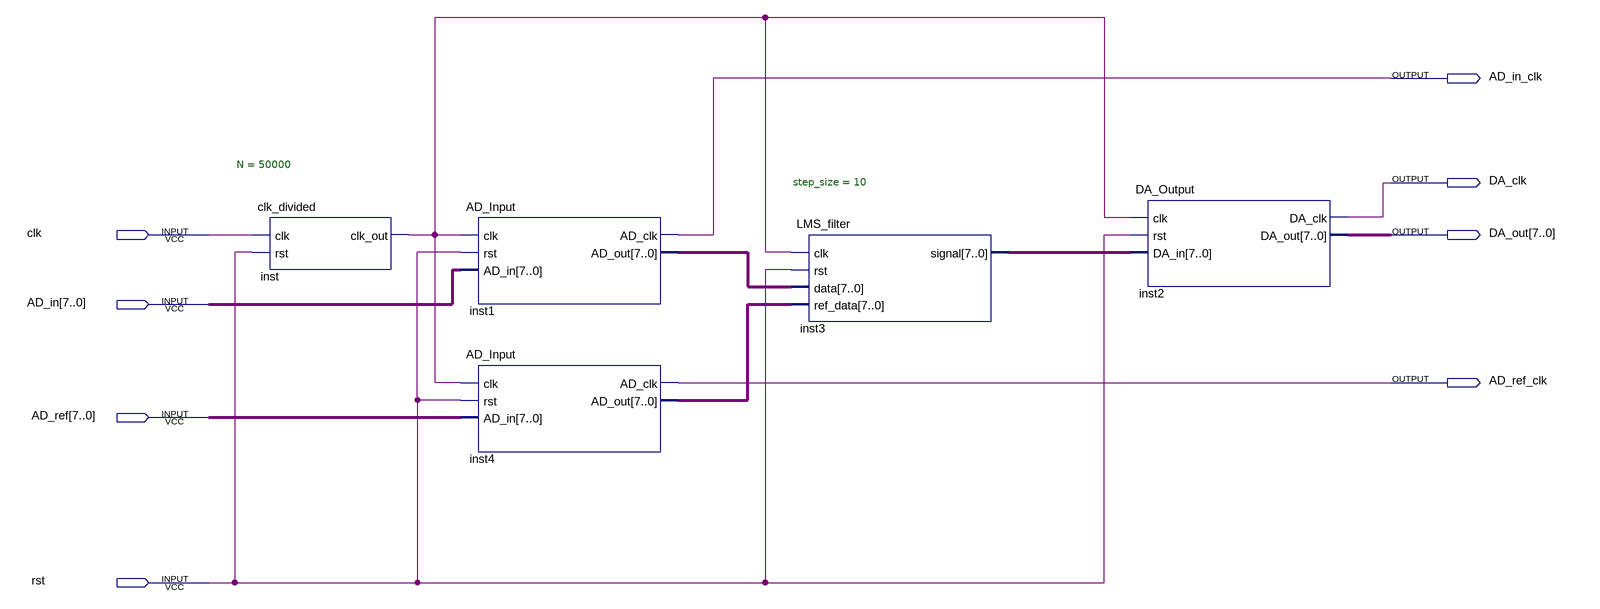
[diagram p0: schematic sheet]
// Quartus schematic ECG.bdf as structural Verilog: 5 symbols, 8 pins
module ECG (
  input  clk,
  input  [7:0] AD_in,
  input  [7:0] AD_ref,
  input  rst,
  output AD_in_clk,
  output DA_clk,
  output [7:0] DA_out,
  output AD_ref_clk
);

  wire inst_clk_out;
  wire [7:0] inst1_ad_out, inst3_signal, inst4_ad_out;

  clk_divided #(.N(50000)) inst (.clk(clk), .rst(rst), .clk_out(inst_clk_out));
  AD_Input inst1 (.clk(inst_clk_out), .rst(rst), .AD_in(AD_in), .AD_clk(AD_in_clk), .AD_out(inst1_ad_out));
  AD_Input inst4 (.clk(inst_clk_out), .rst(rst), .AD_in(AD_ref), .AD_clk(AD_ref_clk), .AD_out(inst4_ad_out));
  LMS_filter #(.step_size(10)) inst3 (
    .clk(inst_clk_out), .rst(rst), .data(inst1_ad_out), .ref_data(inst4_ad_out), .signal(inst3_signal));
  DA_Output inst2 (.clk(inst_clk_out), .rst(rst), .DA_in(inst3_signal), .DA_clk(DA_clk), .DA_out(DA_out));
endmodule
